# EAGLE schematic sub-unit-psu (EAGLE 9.6.2)
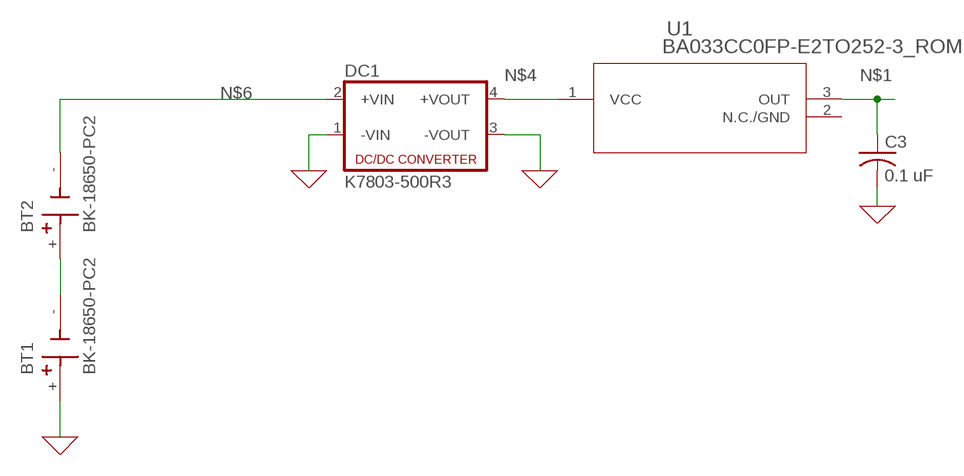
[diagram p0: schematic, sheet 1]

## Parts
BT1  BK-18650-PC2  [BAT_BK-18650-PC2]
BT2  BK-18650-PC2  [BAT_BK-18650-PC2]
C3  0.1 uF  C-US050-024X044  [C050-024X044]
DC1  K7803-500R3  NME  [NME]
U1  BA033CC0FP-E2TO252-3_ROM  [TO252-3_ROM]

## Nets
0: BT1.+ C3.2 DC1.1(-VIN) DC1.3(-VOUT) ; supply symbol labelled GND
N$1: C3.1 U1.3(OUT)
N$2: BT1.- BT2.+
N$4: DC1.4(+VOUT) U1.1(VCC)
N$6: BT2.- DC1.2(+VIN)
Unconnected: U1.2(N.C./GND)

## Library data of the parts
BT1 BT2 = BK-18650-PC2:BK-18650-PC2: Battery Holder (Open) 18650 1 Cell PC Pin Check availability <https://pricing.snapeda.com/parts/BK-18650-PC2/MPD%20%28Memory%20Protection%20Devices%29/view-part?ref=eda>; AVAILABILITY: In Stock; DESCRIPTION: Battery Holder (Open) 18650 1 Cell PC Pin; MF: MPD (Memory Protection Devices); MP: BK-18650-PC2; PACKAGE: None; PRICE: None; PURCHASE-URL: https://pricing.snapeda.com/search/part/BK-18650-PC2/?ref=eda
C3 = rcl:C-US: CAPACITOR, American symbol; SPICEPREFIX: C
DC1 = dc-dc-converter:NME: DC-DC CONVERTER; MF: C & D TECHNOLOGIES, INC; MPN: NME1205D; OC_FARNELL: 1021466; OC_NEWARK: 98B8198
U1 = 2023-03-08_12-17-23_Library:BA033CC0FP-E2; COPYRIGHT: Copyright (C) 2023 Ultra Librarian. All rights reserved.; DIGI-KEY_PART_NUMBER_1: BA033CC0FP-E2TR-ND; DIGI-KEY_PART_NUMBER_2: BA033CC0FP-E2CT-ND; DIGI-KEY_PART_NUMBER_3: BA033CC0FP-E2DKR-ND; MANUFACTURER_PART_NUMBER: BA033CC0FP-E2; MFR_NAME: ROHM Semiconductor